# EAGLE design iv18 (EAGLE 7.4.0)
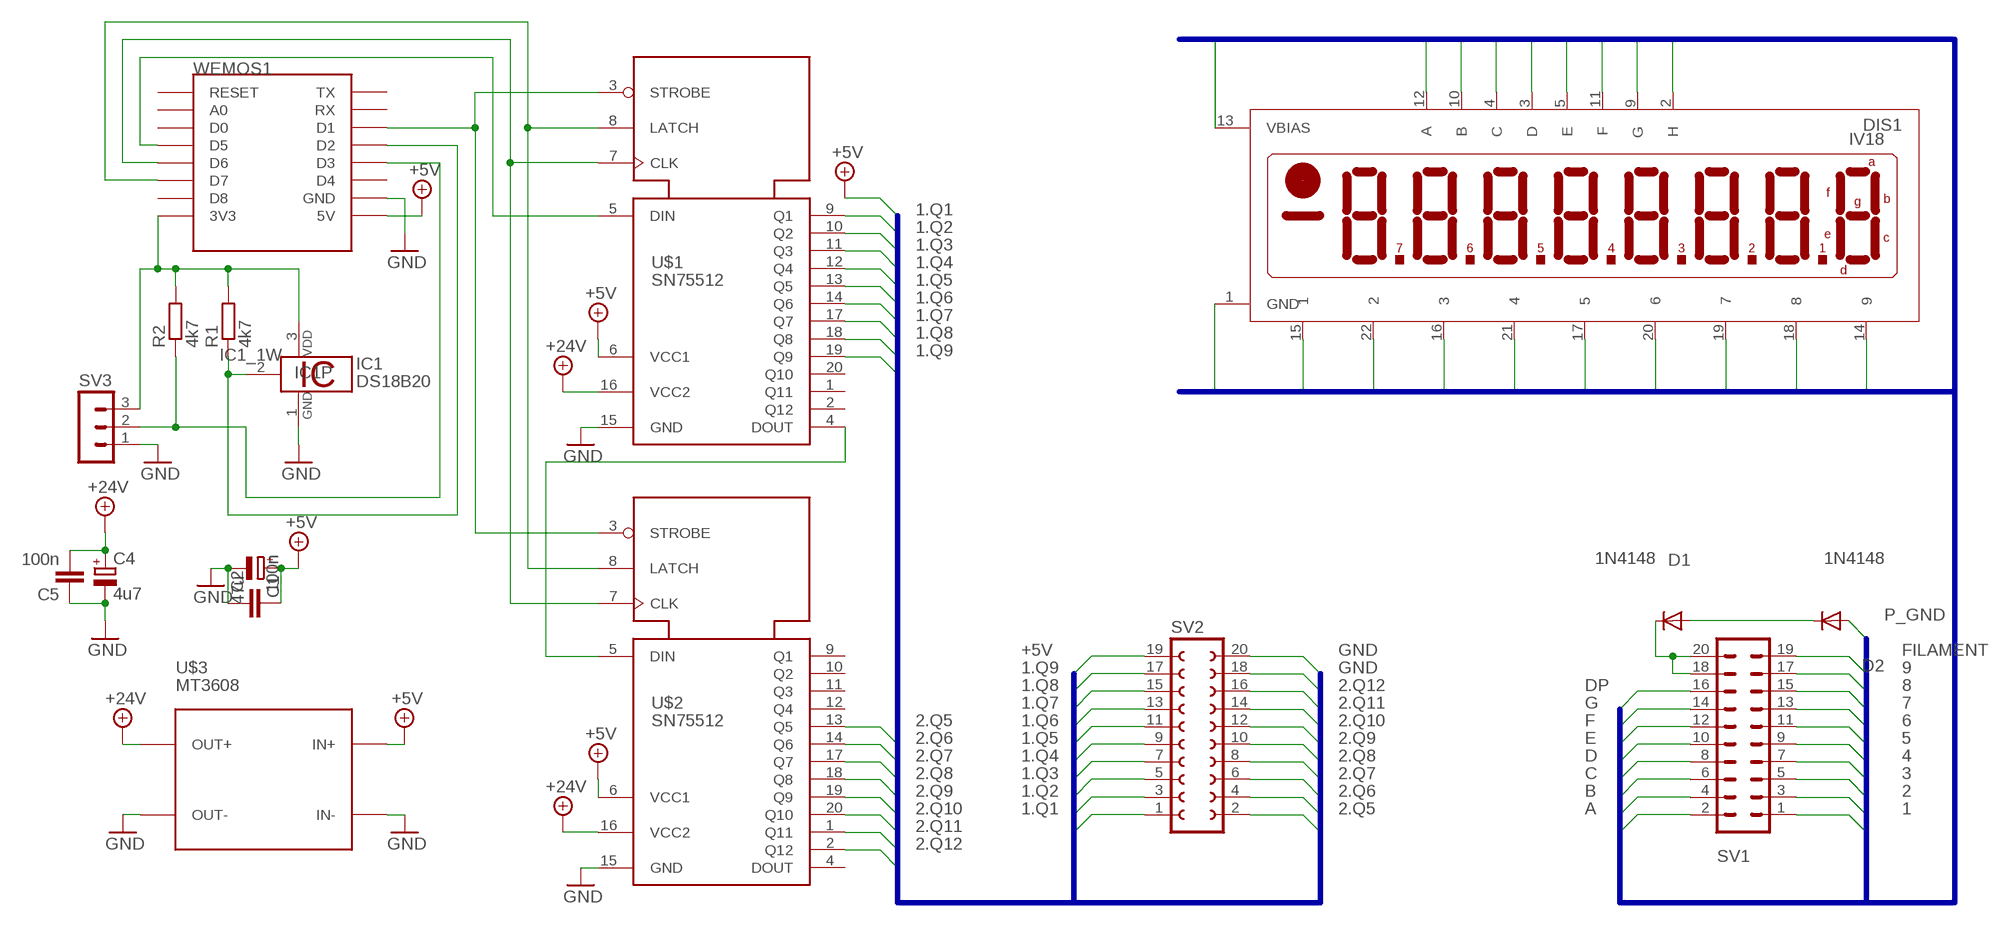
[diagram p0: schematic, sheet 1, part 1 of 2]
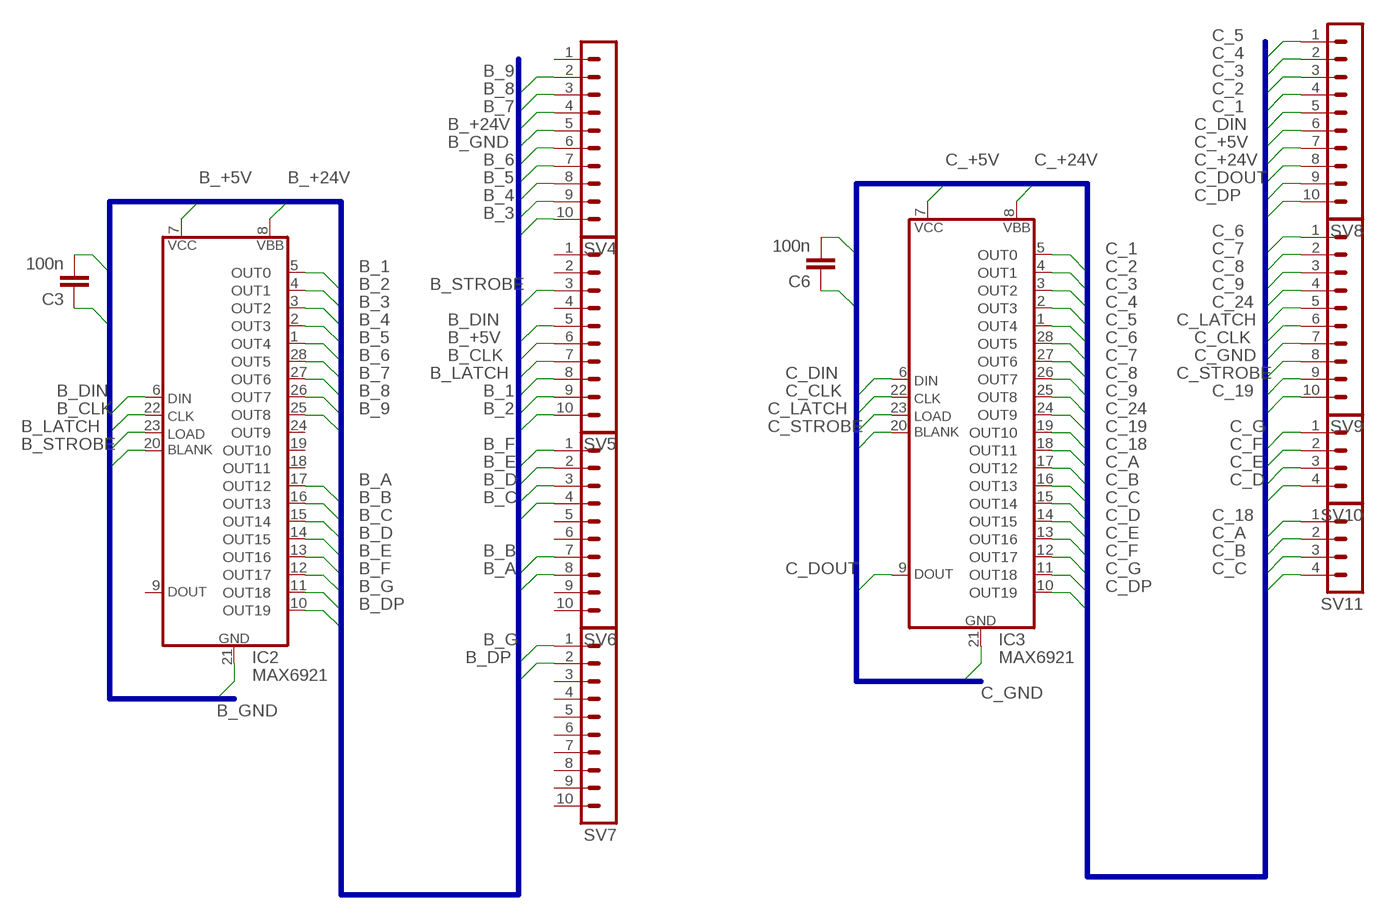
[diagram p1: schematic, sheet 1, part 2 of 2]

## Parts
C1  47u  CPOL-EUE2.5-7  [E2,5-7]
C2  100n  C-EU025-030X050  [C025-030X050]
C3  100n  C-EU025-030X050  [C025-030X050]
C4  4u7  CPOL-EUE2.5-5  [E2,5-5]
C5  100n  C-EU025-030X050  [C025-030X050]
C6  100n  C-EU025-030X050  [C025-030X050]
D1  1N4148  1N4148DO35-7  [DO35-7]
D2  1N4148  1N4148DO35-7  [DO35-7]
DIS1  IV18  [IV18]
IC1  DS18B20  [TO92-]
IC2  MAX6921  IC_MAX6921-TSSOP28  [TSSOP-28]
IC3  MAX6921  IC_MAX6921-TSSOP28  [TSSOP-28]
R1  4k7  R-EU_M1206  [M1206]
R2  4k7  R-EU_M1206  [M1206]
SV1  MA10-2W  [MA10-2W]
SV2  FE10-2  [FE10-2]
SV3  MA03-1  [MA03-1]
SV4  MA10-1  [MA10-1]
SV5  MA10-1  [MA10-1]
SV6  MA10-1  [MA10-1]
SV7  MA10-1  [MA10-1]
SV8  MA10-1  [MA10-1]
SV9  MA10-1  [MA10-1]
SV10  MA04-1  [MA04-1]
SV11  MA04-1  [MA04-1]
U$1  SN75512  [DIL20]
U$2  SN75512  [DIL20]
U$3  MT3608  DC-DC-STEP-UP-MT3608  [DC-DC-STEP-UP-MT3608]
WEMOS1  WEMOS-D1-MINI  [WEMOS-D1-MINI]

## Nets
1: DIS1.15 SV1.1
1.Q1: SV2.1 U$1.9(Q1)
1.Q2: SV2.3 U$1.10(Q2)
1.Q3: SV2.5 U$1.11(Q3)
1.Q4: SV2.7 U$1.12(Q4)
1.Q5: SV2.9 U$1.13(Q5)
1.Q6: SV2.11 U$1.14(Q6)
1.Q7: SV2.13 U$1.17(Q7)
1.Q8: SV2.15 U$1.18(Q8)
1.Q9: SV2.17 U$1.19(Q9)
2: DIS1.22 SV1.3
2.Q5: SV2.2 U$2.13(Q5)
2.Q6: SV2.4 U$2.14(Q6)
2.Q7: SV2.6 U$2.17(Q7)
2.Q8: SV2.8 U$2.18(Q8)
2.Q9: SV2.10 U$2.19(Q9)
2.Q10: SV2.12 U$2.20(Q10)
2.Q11: SV2.14 U$2.1(Q11)
2.Q12: SV2.16 U$2.2(Q12)
3: DIS1.16 SV1.5
4: DIS1.21 SV1.7
5: DIS1.17 SV1.9
6: DIS1.20 SV1.11
7: DIS1.19 SV1.13
8: DIS1.18 SV1.15
9: DIS1.14 SV1.17
+5V: C1.+ C2.2 SV2.19 U$1.6(VCC1) U$2.6(VCC1) U$3.IN+ WEMOS1.5V
+24V: C4.+ C5.2 U$1.16(VCC2) U$2.16(VCC2) U$3.OUT+
A: DIS1.12(A) SV1.2
B: DIS1.10(B) SV1.4
B_1: IC2.5(OUT0) SV5.9
B_2: IC2.4(OUT1) SV5.10
B_3: IC2.3(OUT2) SV4.10
B_4: IC2.2(OUT3) SV4.9
B_5: IC2.1(OUT4) SV4.8
B_6: IC2.28(OUT5) SV4.7
B_7: IC2.27(OUT6) SV4.4
B_8: IC2.26(OUT7) SV4.3
B_9: IC2.25(OUT8) SV4.2
B_+5V: C3.2 IC2.7(VCC) SV5.6
B_+24V: IC2.8(VBB) SV4.5
B_A: IC2.17(OUT12) SV6.8
B_B: IC2.16(OUT13) SV6.7
B_C: IC2.15(OUT14) SV6.4
B_CLK: IC2.22(CLK) SV5.7
B_D: IC2.14(OUT15) SV6.3
B_DIN: IC2.6(DIN) SV5.5
B_DP: IC2.10(OUT19) SV7.2
B_E: IC2.13(OUT16) SV6.2
B_F: IC2.12(OUT17) SV6.1
B_G: IC2.11(OUT18) SV7.1
B_GND: C3.1 IC2.21(GND) SV4.6
B_LATCH: IC2.23(LOAD) SV5.8
B_STROBE: IC2.20(BLANK) SV5.3
C: DIS1.4(C) SV1.6
C_1: IC3.5(OUT0) SV8.5
C_2: IC3.4(OUT1) SV8.4
C_3: IC3.3(OUT2) SV8.3
C_4: IC3.2(OUT3) SV8.2
C_5: IC3.1(OUT4) SV8.1
C_6: IC3.28(OUT5) SV9.1
C_7: IC3.27(OUT6) SV9.2
C_8: IC3.26(OUT7) SV9.3
C_9: IC3.25(OUT8) SV9.4
C_18: IC3.18(OUT11) SV11.1
C_19: IC3.19(OUT10) SV9.10
C_24: IC3.24(OUT9) SV9.5
C_+5V: C6.2 IC3.7(VCC) SV8.7
C_+24V: IC3.8(VBB) SV8.8
C_A: IC3.17(OUT12) SV11.2
C_B: IC3.16(OUT13) SV11.3
C_C: IC3.15(OUT14) SV11.4
C_CLK: IC3.22(CLK) SV9.7
C_D: IC3.14(OUT15) SV10.4
C_DIN: IC3.6(DIN) SV8.6
C_DOUT: IC3.9(DOUT) SV8.9
C_DP: IC3.10(OUT19) SV8.10
C_E: IC3.13(OUT16) SV10.3
C_F: IC3.12(OUT17) SV10.2
C_G: IC3.11(OUT18) SV10.1
C_GND: C6.1 IC3.21(GND) SV9.8
C_LATCH: IC3.23(LOAD) SV9.6
C_STROBE: IC3.20(BLANK) SV9.9
D: DIS1.3(D) SV1.8
DP: DIS1.2(H) SV1.16
E: DIS1.5(E) SV1.10
F: DIS1.11(F) SV1.12
FILAMENT: DIS1.13(VBIAS) SV1.19
G: DIS1.9(G) SV1.14
GND: C1.- C2.1 C4.- C5.1 IC1.1 SV2.18 SV2.20 SV3.1 U$1.15(GND) U$2.15(GND) U$3.IN- U$3.OUT- WEMOS1.GND
N$1: U$1.5(DIN) WEMOS1.D5
N$2: U$1.7(CLK) U$2.7(CLK) WEMOS1.D6
N$3: U$1.8(LATCH) U$2.8(LATCH) WEMOS1.D7
N$4: U$1.3(STROBE) U$2.3(STROBE) WEMOS1.D1
N$5: U$1.4(DOUT) U$2.5(DIN)
N$6: D1.A D2.C
N$7: IC1.3 R1.2 R2.2 SV3.3 WEMOS1.3V3
N$8: IC1.2 R1.1 WEMOS1.D2
N$9: R2.1 SV3.2 WEMOS1.D3
N$11: D1.C SV1.18 SV1.20
P_GND: D2.A DIS1.1(GND)
Unconnected: IC2.9(DOUT) IC2.18(OUT11) IC2.19(OUT10) IC2.24(OUT9) SV4.1 SV5.1 SV5.2 SV5.4 SV6.5 SV6.6 SV6.9 SV6.10 SV7.3 SV7.4 SV7.5 SV7.6 SV7.7 SV7.8 SV7.9 SV7.10 U$1.1(Q11) U$1.2(Q12) U$1.20(Q10) U$2.4(DOUT) U$2.9(Q1) U$2.10(Q2) U$2.11(Q3) U$2.12(Q4) WEMOS1.A0 WEMOS1.D0 WEMOS1.D4 WEMOS1.D8 WEMOS1.RESET WEMOS1.RX WEMOS1.TX

## Buses
1.Q1,1.Q2,1.Q3,1.Q4,1.Q5,1.Q6,1.Q7,1.Q8,1.Q9,2.Q5,2.Q6,2.Q7,2.Q8,2.Q9,2.Q10,2.Q11,2.Q12,+5V,GND
PANELBUSZ:FILAMENT,P_GND,A,B,C,D,E,F,G,DP,1,2,3,4,5,6,7,8,9
BOBBUSZ2:C_GND,C_+24V,C_+5V,C_CLK,C_DIN,C_DOUT,C_LATCH,C_STROBE,C_1,C_2,C_3,C_4,C_5,C_6,C_7,C_8,C_9,C_DP,C_G,C_F,C_E,C_D,C_C,C_B,C_A,C_24,C_19,C_18

## Library data of the parts
C1 C4 = rcl:CPOL-EU: POLARIZED CAPACITOR, European symbol
C2 C3 C5 C6 = rcl:C-EU: CAPACITOR, European symbol
D1 D2 = diode:1N4148: DIODE high speed (Philips)
DIS1 = adafruit:IV18: LCD DISPLAY 8-character 7 segment
IC1 = 1wire:DS18B20: Programmable Resolution Digital Thermometer This chip provides a onewire thermosensor with approx. 0.5°C accuracy. A programmable over/undertemperure alarm is available. The precision can be set from 9..12 bits. Notes: Vdd must be applied for accurate measurements at low temperatures, as the parasite power circuit otherwise heats the sensor. If parasite power is used, Vdd has to be connected to GND. The DS1822 is a low-cost thermometer chip, the DS18S20 is similar to the DS18B20, but with 9 Bit precision only. Author: Jan Kandziora <jjj@gmx.de>
IC2 IC3 = dp_devices.v6:IC_MAX6921: 20-outputs, 76V, serial VFD driver Dangerousprototypes.com
R1 R2 = rcl:R-EU_: RESISTOR, European symbol
SV1 = con-lstb:MA10-2W: PIN HEADER; OC_FARNELL: unknown; OC_NEWARK: unknown
SV2 = con-lsta:FE10-2: FEMALE HEADER; OC_FARNELL: unknown; OC_NEWARK: unknown
SV3 = con-lstb:MA03-1: PIN HEADER; OC_FARNELL: unknown; OC_NEWARK: unknown
SV4-SV9 = con-lstb:MA10-1: PIN HEADER; OC_FARNELL: unknown; OC_NEWARK: unknown
SV10 SV11 = con-lstb:MA04-1: PIN HEADER; OC_FARNELL: unknown; OC_NEWARK: unknown
U$1 U$2 = 755xx:SN75512
U$3 = diy-modules:DC-DC-STEP-UP-MT3608: DC/DC Step-Up Regulator based on MT3608 chip MT3608 datasheet available here: https://www.olimex.com/Products/Breadboarding/BB-PWR-3608/resources/MT3608.pdf Click here to find device on ebay.com <http://www.ebay.com/sch/mt3608+module>
WEMOS1 = esp8266modules:WEMOS-D1-MINI: WeMos.cc D1 mini ESP8266 module

## Board
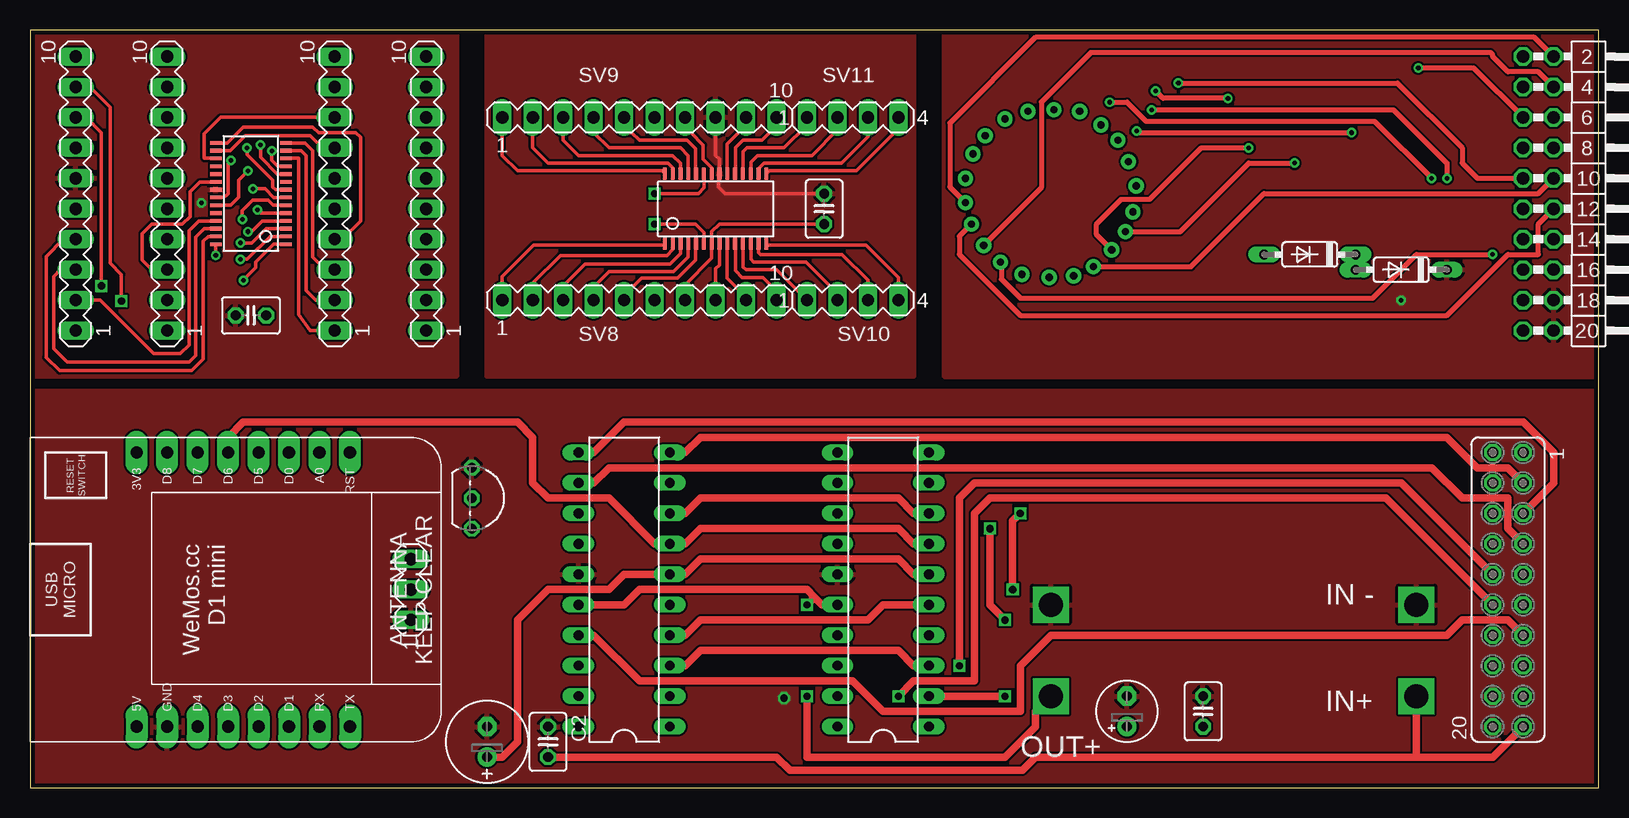
[diagram p2: board, top side]
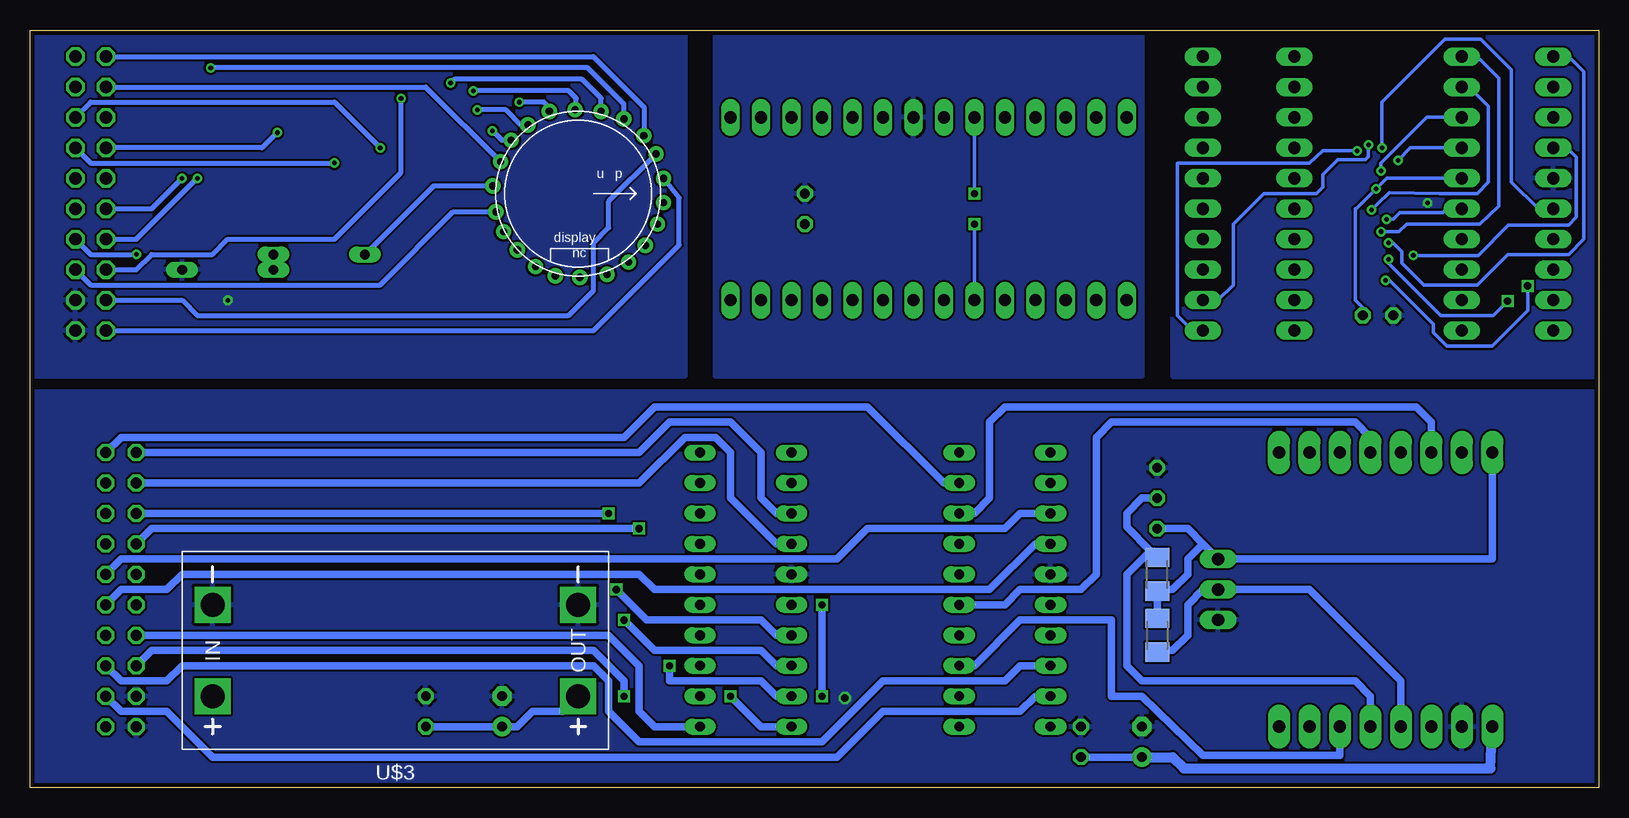
[diagram p3: board, bottom side, seen from below]

Size 130.79 x 63.17 mm. Coordinates in mm from the lower left corner, seen from the top.
Outline: 0,0 130.79,0 130.79,63.17 0,63.17 0,0
Copper layers (1*16): Top 0.035mm / dielectric 1.5mm / Bottom 0.035mm
Design rules "default *": minimum track width 5mil, minimum drill 12mil, track to track 7mil, track to pad 5mil, pad to pad 5mil, via to via 5mil, smd to smd 5mil, copper to edge 15mil, drill to drill 8mil, minimum pad ring 10mil, minimum via ring 8mil, stop-mask expansion 4mil, vias tented up to drill 0mil, thermal gap 10mil

### Footprints (pad centres in the part's own frame; a part is rotated, then mirrored left to right if it is on the bottom)
E2,5-7 = drill 0.813 pad 1.6: + -1.27,0 | drill 0.813 pad 1.6 octagon: - 1.27,0
C025-030X050 = drill 0.813 octagon: 1 -1.27,0; 2 1.27,0
E2,5-5 = drill 0.813 pad 1.6: + -1.27,0 | drill 0.813 pad 1.6 octagon: - 1.27,0
DO35-7 = drill 0.813 long: A 3.81,0; C -3.81,0
IV18 = drill 0.6 pad 1.27: 1 -0.635,-7.112; 2 1.524,-6.858; 3 3.175,-6.223; 4 4.699,-5.08; 5 6.096,-3.556; 6 6.858,-1.905; 7 6.985,0.127; 8 6.731,2.413; 9 5.715,4.191; 10 4.318,5.588; 11 2.54,6.604; 12 0.762,7.112; 13 -1.27,7.112; 14 -3.302,6.477; 15 -4.826,5.461; 16 -6.223,3.81; 17 -6.858,1.905; 18 -6.985,-0.254; 19 -6.858,-2.413; 20 -5.715,-4.191; 21 -4.445,-5.588; 22 -2.667,-6.477
TO92- = drill 0.813 octagon: 1 -2.54,0; 2 0,0; 3 2.54,0
TSSOP-28 = smd 0.305 x 0.991: 1 -4.225,-2.918; 2 -3.575,-2.918; 3 -2.925,-2.918; 4 -2.275,-2.918; 5 -1.625,-2.918; 6 -0.975,-2.918; 7 -0.325,-2.918; 8 0.325,-2.918; 9 0.975,-2.918; 10 1.625,-2.918; 11 2.275,-2.918; 12 2.925,-2.918; 13 3.575,-2.918; 14 4.225,-2.918; 15 4.225,2.918; 16 3.575,2.918; 17 2.925,2.918; 18 2.275,2.918; 19 1.625,2.918; 20 0.975,2.918; 21 0.325,2.918; 22 -0.325,2.918; 23 -0.975,2.918; 24 -1.625,2.918; 25 -2.275,2.918; 26 -2.925,2.918; 27 -3.575,2.918; 28 -4.225,2.918
M1206 = smd 1.6 x 2: 1 -1.4,0; 2 1.4,0
MA10-2W = drill 1.016 octagon: 1 -11.43,-1.27; 2 -11.43,1.27; 3 -8.89,-1.27; 4 -8.89,1.27; 5 -6.35,-1.27; 6 -6.35,1.27; 7 -3.81,-1.27; 8 -3.81,1.27; 9 -1.27,-1.27; 10 -1.27,1.27; 11 1.27,-1.27; 12 1.27,1.27; 13 3.81,-1.27; 14 3.81,1.27; 15 6.35,-1.27; 16 6.35,1.27; 17 8.89,-1.27; 18 8.89,1.27; 19 11.43,-1.27; 20 11.43,1.27
FE10-2 = drill 0.914 octagon: 1 -11.43,1.27; 2 -11.43,-1.27; 3 -8.89,1.27; 4 -8.89,-1.27; 5 -6.35,1.27; 6 -6.35,-1.27; 7 -3.81,1.27; 8 -3.81,-1.27; 9 -1.27,1.27; 10 -1.27,-1.27; 11 1.27,1.27; 12 1.27,-1.27; 13 3.81,1.27; 14 3.81,-1.27; 15 6.35,1.27; 16 6.35,-1.27; 17 8.89,1.27; 18 8.89,-1.27; 19 11.43,1.27; 20 11.43,-1.27
MA03-1 = drill 1.016 long: 1 -2.54,0; 2 0,0; 3 2.54,0
MA10-1 = drill 1.016 long: 1 -11.43,0; 2 -8.89,0; 3 -6.35,0; 4 -3.81,0; 5 -1.27,0; 6 1.27,0; 7 3.81,0; 8 6.35,0; 9 8.89,0; 10 11.43,0
MA04-1 = drill 1.016 long: 1 -3.81,0; 2 -1.27,0; 3 1.27,0; 4 3.81,0
DIL20 = drill 0.813 long: 1 -11.43,-3.81; 2 -8.89,-3.81; 3 -6.35,-3.81; 4 -3.81,-3.81; 5 -1.27,-3.81; 6 1.27,-3.81; 7 3.81,-3.81; 8 6.35,-3.81; 9 8.89,-3.81; 10 11.43,-3.81; 11 11.43,3.81; 12 8.89,3.81; 13 6.35,3.81; 14 3.81,3.81; 15 1.27,3.81; 16 -1.27,3.81; 17 -3.81,3.81; 18 -6.35,3.81; 19 -8.89,3.81; 20 -11.43,3.81
DC-DC-STEP-UP-MT3608 = drill 2 pad 2.8 square: IN+ 15.24,3.81; IN- 15.24,-3.81; OUT+ -15.24,3.81; OUT- -15.24,-3.81
WEMOS-D1-MINI = drill 1.016 pad 1.829 long: 3V3 -10.16,-10.16; 5V 12.7,-10.16; A0 -10.16,5.08; D0 -10.16,2.54; D1 12.7,2.54; D2 12.7,0; D3 12.7,-2.54; D4 12.7,-5.08; D5 -10.16,0; D6 -10.16,-2.54; D7 -10.16,-5.08; D8 -10.16,-7.62; GND 12.7,-7.62; RESET -10.16,7.62; RX 12.7,5.08; TX 12.7,7.62

### Placement (x,y rotation side)
C1  38.1,3.81 90 top
C2  43.18,3.81 270 top
C3  18.41,39.37 0 top
C4  91.44,6.35 90 top
C5  97.79,6.35 270 top
C6  66.2,48.26 270 top
D1  114.3,43.18 180 top
D2  106.68,44.45 180 top
DIS1  85.09,49.53 270 bottom
IC1  36.83,24.13 270 top
IC2  18.41,49.53 90 top
IC3  57.15,48.26 0 top
R1  36.83,17.78 270 bottom
R2  36.83,12.7 90 bottom
SV1  125.73,49.53 270 top
SV2  123.19,16.51 270 top
SV3  31.75,16.51 90 top
SV4  3.81,49.53 90 top
SV5  11.43,49.53 90 top
SV6  25.4,49.53 90 top
SV7  33.02,49.53 90 top
SV8  50.8,40.64 0 top
SV9  50.8,55.88 0 top
SV10  68.58,40.64 0 top
SV11  68.58,55.88 0 top
U$1  49.53,16.51 90 top
U$2  71.12,16.51 90 top
U$3  100.33,11.43 180 bottom
WEMOS1  19.05,17.78 270 top

### Tracks (layer width: path | path; a pad name or v marks a point on that pad's centre or on a via)
1
  Bottom 0.406: SV1.1 83.82,60.96 79.61,56.75 79.61,54.37 DIS1.15
1.Q1
  Bottom 0.61: SV2.1 123.19,29.21 81.28,29.21 78.74,31.75 60.96,31.75 54.61,25.4 U$1.9
1.Q2
  Top 0.61: SV2.3 123.19,26.67 120.65,26.67 118.11,29.21 55.88,29.21 54.61,27.94 U$1.10
1.Q3
  Top 0.61: SV2.5 127,25.4 127,27.94 124.46,30.48 49.53,30.48 46.99,27.94 U$1.11
1.Q4
  Top 0.61: SV2.7 123.19,21.59 123.19,24.13 119.38,24.13 116.84,26.67 48.26,26.67 46.99,25.4 U$1.12
1.Q5
  Bottom 0.61: SV2.9 123.19,19.05 63.5,19.05 60.96,21.59 49.53,21.59 48.26,22.86 U$1.13
1.Q6
  Bottom 0.61: SV2.11 123.19,16.51 119.38,16.51 118.11,17.78 80.01,17.78 78.74,16.51 50.8,16.51 46.99,20.32 U$1.14
1.Q7
  Top 0.61: SV2.13 123.19,13.97 119.38,13.97 118.11,12.7 85.09,12.7 82.55,10.16 82.55,6.35 71.12,6.35 68.58,8.89 50.8,8.89 46.99,12.7 U$1.17
1.Q8
  Bottom 0.61: SV2.15 123.19,8.89 119.38,8.89 118.11,10.16 83.82,10.16 82.55,8.89 82.55,6.35 80.01,3.81 64.77,3.81 59.69,8.89 49.53,8.89 48.26,10.16 U$1.18
1.Q9
  Bottom 0.61: SV2.17 123.19,6.35 119.38,6.35 115.57,2.54 63.5,2.54 59.69,6.35 48.26,6.35 46.99,7.62 U$1.19
2
  Bottom 0.406: SV1.3 97.79,58.42 DIS1.22
2.Q5
  Bottom 0.61: SV2.2 80.01,27.94 77.47,30.48 72.39,30.48 69.85,27.94 69.85,24.13 68.58,22.86 U$2.13
2.Q6
  Bottom 0.61: SV2.4 80.01,25.4 76.2,29.21 73.66,29.21 72.39,27.94 72.39,24.13 68.58,20.32 U$2.14
2.Q7  (via drill 0.6)
  Top 0.61: v82.55,22.86 81.92,22.23 v81.92,16.51
  Bottom 0.61: SV2.6 v82.55,22.86 | v81.92,16.51 79.38,13.97 69.85,13.97 68.58,12.7 U$2.17
2.Q8  (via drill 0.6)
  Top 0.61: v80.01,21.59 80.01,15.24 v81.28,13.97
  Bottom 0.61: SV2.8 120.65,21.59 v80.01,21.59 | v81.28,13.97 78.74,11.43 69.85,11.43 68.58,10.16 U$2.18
2.Q9  (via drill 0.6)
  Top 0.61: SV2.10 114.3,25.4 78.74,25.4 77.47,24.13 v77.47,10.16
  Bottom 0.61: v77.47,10.16 77.47,8.89 69.85,8.89 68.58,7.62 U$2.19
2.Q10  (via drill 0.6)
  Top 0.61: SV2.12 113.03,24.13 80.01,24.13 78.74,22.86 78.74,8.89 73.66,8.89 v72.39,7.62
  Bottom 0.61: v72.39,7.62 69.85,5.08 U$2.20
2.Q11
  Bottom 0.61: SV2.14 82.55,12.7 80.01,10.16 80.01,6.35 78.74,5.08 U$2.1
2.Q12  (via drill 0.6)
  Top 0.61: v81.28,7.62 U$2.2
  Bottom 0.61: SV2.16 120.65,11.43 83.82,11.43 81.28,8.89 v81.28,7.62
3  (via drill 0.38)
  Top 0.406: v115.73,60.01 120.33,60.01 SV1.5
  Bottom 0.406: DIS1.16 81.28,56.99 84.3,60.01 v115.73,60.01
4  (via drill 0.38)
  Top 0.406: v92.23,54.77 92.39,54.61 v110.17,54.61
  Bottom 0.406: DIS1.21 91.44,53.98 v92.23,54.77 | v110.17,54.61 111.44,53.34 SV1.7
5  (via drill 0.38)
  Top 0.406: v95.73,58.74 113.98,58.74 119.38,53.34 119.38,52.07 120.65,50.8 SV1.9
  Bottom 0.406: DIS1.17 83.19,57.47 84.77,59.05 95.41,59.05 v95.73,58.74
6  (via drill 0.38)
  Top 0.406: v93.5,56.52 113.67,56.52 118.11,52.07 v118.11,50.8
  Bottom 0.406: DIS1.20 89.85,55.24 91.12,56.52 v93.5,56.52 | SV1.11 120.65,48.26 v118.11,50.8
7  (via drill 0.38)
  Top 0.406: v90.01,57.15 91.44,57.15 93.03,55.56 112.08,55.56 v116.84,50.8
  Bottom 0.406: DIS1.19 87.5,56.71 87.95,57.15 v90.01,57.15 | SV1.13 121.92,45.72 v116.84,50.8
8  (via drill 0.38)
  Top 0.406: v99.85,57.47 94.46,57.47 v93.82,58.1
  Bottom 0.406: DIS1.18 85.25,56.61 85.25,57.47 85.88,58.1 v93.82,58.1 | SV1.15 121.92,43.18 120.65,44.45 115.57,44.45 114.3,45.72 105.41,45.72 99.85,51.28 v99.85,57.47
9
  Bottom 0.406: SV1.17 118.11,40.64 116.84,39.37 85.88,39.37 83.82,41.43 83.82,45.4 82.55,46.67 82.55,48.9 DIS1.14
+5V
  Top 0.61: U$2.6 73.66,17.78 72.39,19.05 55.88,19.05 54.61,17.78 U$1.6 49.53,17.78 48.26,16.51 43.18,16.51 40.64,13.97 40.64,3.81 39.37,2.54 C1.+ | SV2.19 121.92,2.54 115.57,2.54 | 115.57,2.54 83.82,2.54 82.71,1.43 63.34,1.43 62.23,2.54 C2.2 | U$3.IN+ 115.57,2.54
  Bottom 0.61: C1.+ C2.2
  Bottom 0.813: C1.+ 35.56,2.54 34.61,1.59 9.05,1.59 WEMOS1.5V
+24V  (via drill 0.6)
  Top 0.61: U$2.16 66.04,15.24 65.41,15.88 | 65.41,15.88 64.77,16.51 50.8,16.51 49.53,15.24 U$1.16 | U$3.OUT+ 83.82,6.35 83.82,5.08 81.28,2.54 64.77,2.54 v64.77,7.62 | v64.77,15.24 65.41,15.88
  Bottom 0.61: U$3.OUT+ 86.36,6.35 88.9,6.35 90.17,5.08 C4.+ C5.2 | v64.77,7.62 v64.77,15.24
A
  Top 0.406: SV1.2 125.41,62.55 83.82,62.55 76.68,55.4 76.68,50.07 DIS1.12
B
  Top 0.406: SV1.4 125.73,59.69 123.19,59.69 121.92,60.96 121.92,61.12 121.76,61.28 88.42,61.28 84.3,57.15 84.3,50.01 DIS1.10
B_1  (via drill 0.38)
  Top 0.305: v18.97,48.18 19.25,47.91 IC2.5
  Bottom 0.305: SV5.9 10.79,58.42 9.21,56.83 9.21,50.48 10.16,49.53 13.26,49.53 17.46,49.61 18.49,48.66 v18.97,48.18
B_2  (via drill 0.38)
  Top 0.305: IC2.4 21.31,47.23 19.37,47.23 18.49,46.35 v18.18,46.35
  Bottom 0.305: SV5.10 10.16,60.96 8.33,59.13 8.33,48.5 9.92,46.99 16.03,46.99 16.67,46.35 v18.18,46.35
B_3  (via drill 0.38)
  Top 0.305: IC2.3 21.32,46.59 19.68,46.59 18.49,45.4 v17.54,45.4
  Bottom 0.305: v17.54,45.4 17.14,45.4 16.43,44.69 16.43,43.74 14.61,41.91 10.16,41.91 7.62,44.45 2.54,44.45 1.27,45.72 1.27,59.69 2.54,60.96 SV4.10
B_4  (via drill 0.38, 0.6)
  Top 0.305: IC2.2 20,45.96 18.1,44.05 v17.54,44.05 | v7.62,40.56 7.62,42.78 6.67,43.74 6.67,56.75 4.92,58.5 3.89,58.5 SV4.9
  Bottom 0.305: v17.54,44.05 17.54,43.74 13.18,39.37 8.81,39.37 v7.62,40.56
B_5  (via drill 0.38, 0.6)
  Top 0.305: IC2.1 20.3,45.3 18.81,43.81 18.81,43.34 v17.78,42.31 | v5.95,41.83 5.95,54.61 4.68,55.88 SV4.8
  Bottom 0.305: v17.78,42.31 17.46,42.31 13.81,38.66 13.81,37.94 12.7,36.83 8.89,36.83 5.95,39.77 v5.95,41.83
B_6  (via drill 0.38)
  Top 0.305: IC2.28 15.5,44.39 v15.48,44.37
  Bottom 0.305: v15.48,44.37 10.08,44.37 7.54,46.91 2.54,46.91 1.91,47.55 1.91,52.55 2.7,53.34 SV4.7
B_7
  Top 0.305: IC2.27 14.84,45.96 14.45,45.56 14.45,35.72 13.49,34.77 2.46,34.77 1.35,35.88 1.35,44.29 2.78,45.72 SV4.4
B_8
  Top 0.305: IC2.26 15.48,46.59 14.53,46.59 13.81,45.88 13.81,36.04 13.26,35.48 3.1,35.48 1.98,36.59 1.98,42.62 2.54,43.18 SV4.3
B_9
  Top 0.305: IC2.25 15.47,47.23 14.05,47.23 13.26,46.43 13.26,36.91 12.54,36.2 10.32,36.2 5.87,40.64 SV4.2
B_+5V  (via drill 0.38)
  Top 0.305: IC2.7 20.33,49.2 19.61,49.93 v18.57,49.93
  Bottom 0.305: SV5.6 17.7,50.8 v18.57,49.93 20.24,48.26 20.32,48.26 20.32,40.64 19.68,40.01 C3.2
B_+24V  (via drill 0.38)
  Top 0.305: IC2.8 20.64,49.85 20.48,49.85 20.24,50.09 20.24,50.64 18.1,52.78 v18.1,53.34
  Bottom 0.305: SV4.5 5.08,48.26 7.3,50.48 7.3,59.85 9.84,62.39 12.86,62.39 18.1,57.15 v18.1,53.34
B_A
  Top 0.305: IC2.17 15.48,52.47 14.53,52.47 14.53,54.53 15.88,55.88 SV6.8
B_B
  Top 0.305: IC2.16 16.67,53.1 17.94,54.37 23.34,54.37 24.37,53.34 SV6.7
B_C
  Top 0.305: IC2.15 15.52,53.74 16.43,53.74 17.78,55.09 23.57,55.09 24.05,54.61 27.15,54.61 27.54,54.21 27.54,47.23 26.04,45.72 SV6.4
B_CLK  (via drill 0.38)
  Top 0.305: IC2.22 15.51,49.21 16.11,49.21 16.35,49.37 16.51,49.53 16.51,51.99 v16.75,52.31
  Bottom 0.305: 12.86,53.34 SV5.7 15.72,53.34 v16.75,52.31
B_D
  Top 0.305: IC2.14 21.35,53.74 22.94,53.74 23.57,53.1 23.57,44.21 24.61,43.18 SV6.3
B_DIN  (via drill 0.38)
  Top 0.305: IC2.6 20.26,48.55 19.84,48.97 18.57,48.97 17.7,48.1 v17.7,47.39
  Bottom 0.305: SV5.5 12.7,48.26 13.02,47.94 16.59,47.94 17.14,47.39 v17.7,47.39
B_DP  (via drill 0.38)
  Top 0.305: IC2.10 20.6,51.16 19.21,52.55 v19.21,53.58
  Bottom 0.305: SV7.2 31.75,40.64 30.48,41.91 30.48,46.99 27.94,49.53 23.57,49.53 23.02,50.09 23.02,51.12 21.79,52.35 19.49,52.35 19.21,52.63 v19.21,53.58
B_E
  Top 0.305: IC2.13 22.62,53.1 23.02,52.7 23.02,41.43 23.81,40.64 SV6.2
B_F
  Top 0.305: SV6.1 23.34,38.1 22.38,39.45 22.38,52.47 21.34,52.47 IC2.12
B_G  (via drill 0.38)
  Top 0.305: IC2.11 20.66,51.8 20.16,52.31 v20.16,53.1
  Bottom 0.305: v20.16,53.1 23.02,53.1 24.13,52.07 35.16,52.07 35.16,39.37 33.89,38.1 SV7.1
B_GND  (via drill 0.38)
  other vias: 14.29,48.74
  pour Bottom: 0,34.29 0,63.18 35.56,63.18 35.56,34.29
  pour Top: 0,34.29 0,63.18 35.56,63.18 35.56,34.29
B_LATCH  (via drill 0.38)
  Top 0.305: IC2.23 15.52,48.58 16.75,48.58 17.38,49.21 17.38,50.64 v18.18,51.44
  Bottom 0.305: 11.59,55.88 SV5.8 14.37,55.88 18.18,52.07 v18.18,51.44
B_STROBE
  Top 0.305: IC2.20 15.47,50.48 14.13,50.48 13.34,49.69 13.34,47.62 12.7,46.99 10.16,46.99 9.37,46.2 9.37,43.97 10.16,43.18 SV5.3
C  (via drill 0.38)
  Top 0.406: DIS1.4 88.9,46.1 88.9,46.99 90.96,49.05 93.34,49.05 97.63,53.34 v101.6,53.34
  Bottom 0.406: SV1.6 125.73,57.15 105.41,57.15 v101.6,53.34
C_1
  Top 0.305: IC3.5 55.48,45.3 55.48,43.97 53.98,42.47 50.96,42.47 49.53,41.04 SV8.5
C_2
  Top 0.305: IC3.4 54.85,45.31 54.85,44.21 53.66,43.02 48.26,43.02 46.99,41.75 SV8.4
C_3
  Top 0.305: IC3.3 54.21,45.33 54.21,44.53 53.34,43.66 46.28,43.66 44.45,41.83 SV8.3
C_4
  Top 0.305: IC3.2 53.58,44.85 53.1,44.37 44.21,44.37 41.91,42.07 SV8.2
C_5
  Top 0.305: IC3.1 52.83,45.24 41.99,45.24 39.37,42.62 SV8.1
C_6
  Top 0.305: IC3.28 52.67,51.44 40.64,51.44 39.37,52.7 SV9.1
C_7
  Top 0.305: IC3.27 53.58,51.67 53.18,52.07 43.18,52.07 41.91,53.34 SV9.2
C_8
  Top 0.305: IC3.26 54.21,51.19 54.21,52.07 53.58,52.7 45.72,52.7 44.45,53.98 SV9.3
C_9
  Top 0.305: IC3.25 54.85,51.2 54.85,52.7 54.21,53.34 48.26,53.34 46.99,54.61 SV9.4
C_18
  Top 0.305: IC3.18 59.45,51.2 59.45,53.02 59.77,53.34 62.87,53.34 64.77,55.24 SV11.1
C_19
  Top 0.305: IC3.19 58.82,51.22 58.82,53.34 59.45,53.98 61.04,53.98 62.23,55.17 SV9.10
C_24
  Top 0.305: IC3.24 55.48,51.22 55.48,53.26 54.77,53.98 50.8,53.98 50.16,54.61 49.53,54.61 SV9.5
C_+5V
  Top 0.305: C6.2 57.47,46.99 56.83,46.35 56.83,45.35 IC3.7 56.83,45.34 56.83,44.13 54.61,41.91 SV8.7
C_+24V
  Top 0.305: IC3.8 57.47,45.34 57.47,43.58 57.15,43.26 SV8.8
C_A
  Top 0.305: IC3.17 60.09,51.19 60.09,52.15 60.64,52.7 65.17,52.7 67.31,54.85 SV11.2
C_B
  Top 0.305: IC3.16 60.72,51.59 61.2,52.07 67.63,52.07 69.85,54.29 SV11.3
C_C
  Top 0.305: IC3.15 61.63,51.44 68.9,51.44 72.39,54.93 SV11.4
C_CLK
  Top 0.305: IC3.22 56.83,51.19 56.83,51.67 56.12,52.39 56.12,53.58 55.09,54.61 54.61,54.61 SV9.7
C_D
  Top 0.305: IC3.14 61.47,45.24 69.69,45.24 72.39,42.55 SV10.4
C_DIN  (via drill 0.6)
  Top 0.305: IC3.6 56.2,45.37 56.2,46.28 55.48,46.99 v52.07,46.99
  Bottom 0.305: v52.07,46.99 SV8.6
C_DOUT
  Top 0.305: IC3.9 58.1,45.32 58.1,42.47 59.69,40.88 SV8.9
C_DP
  Top 0.305: IC3.10 58.82,45.3 58.82,43.1 59.37,42.55 61.12,42.55 62.23,41.43 SV8.10
C_E
  Top 0.305: IC3.13 60.72,44.61 60.88,44.45 67.71,44.45 69.85,42.31 SV10.3
C_F
  Top 0.305: IC3.12 60.09,45.33 60.09,44.05 60.33,43.81 64.69,43.81 67.31,41.2 SV10.2
C_G
  Top 0.305: IC3.11 59.45,45.31 59.45,43.42 59.69,43.18 62.23,43.18 SV10.1
C_GND
  Top 0.305: SV9.8 57.15,52.7 57.47,52.39 57.47,51.19 IC3.21 57.39,51.09 57.39,50.09 57.94,49.53 C6.1
  pour Bottom: 38.1,34.29 73.66,34.29 73.66,63.18 38.1,63.18
  pour Top: 73.66,34.29 38.1,34.29 38.1,63.18 73.66,63.18
C_LATCH  (via drill 0.6)
  Top 0.305: IC3.23 56.2,51.16 56.2,50.01 55.72,49.53 v52.07,49.53
  Bottom 0.305: v52.07,49.53 SV9.6
C_STROBE
  Top 0.305: IC3.20 58.1,51.2 58.1,53.66 59.69,55.24 SV9.9
D  (via drill 0.38)
  Top 0.406: DIS1.3 95.89,46.35 101.6,52.07 v105.41,52.07
  Bottom 0.406: SV1.8 125.73,52.07 v105.41,52.07
DP
  Bottom 0.406: SV1.16 125.73,41.91 101.6,41.91 95.5,48.01 DIS1.2
E
  Top 0.406: DIS1.5 96.77,43.43 102.87,49.53 125.73,49.53 SV1.10
F
  Top 0.406: DIS1.11 77.47,45.97 77.47,44.45 82.55,39.37 118.11,39.37 123.19,44.45 125.73,44.45 125.73,46.99 SV1.12
FILAMENT
  Bottom 0.406: SV1.19 83.82,38.1 76.68,45.24 76.68,49.18 DIS1.13
G  (via drill 0.38)
  Top 0.406: DIS1.9 80.96,43.75 80.96,42.39 82.55,40.8 111.92,40.8 115.57,44.45 v121.92,44.45
  Bottom 0.406: SV1.14 125.73,44.45 v121.92,44.45
GND  (via drill 0.6)
  other vias: 62.87,7.46
  pour Bottom: 130.81,0 130.81,33.02 0,33.02 0,0
  pour Top: 130.81,0 130.81,33.02 0,33.02 0,0
N$1
  Bottom 0.61: U$1.5 49.53,15.24 48.26,16.51 43.18,16.51 41.91,17.78 41.91,29.21 40.64,30.48 20.32,30.48 19.05,29.21 WEMOS1.D5
N$2
  Top 0.61: U$2.7 73.66,20.32 72.39,21.59 55.88,21.59 54.61,20.32 U$1.7 52.07,20.32 48.26,24.13 43.18,24.13 41.91,25.4 41.91,29.21 40.64,30.48 17.78,30.48 16.51,29.21 WEMOS1.D6
N$3
  Top 0.61: U$2.8 73.66,22.86 72.39,24.13 55.88,24.13 54.61,22.86 U$1.8
  Bottom 0.61: U$1.8 52.07,22.86 50.8,24.13 50.8,30.48 49.53,31.75 15.24,31.75 13.97,30.48 WEMOS1.D7
N$4
  Top 0.61: U$2.3 73.66,10.16 72.39,11.43 55.88,11.43 54.61,10.16 U$1.3
  Bottom 0.61: WEMOS1.D1 21.59,2.7 33.02,2.7 38.1,7.62 40.64,7.62 40.64,13.97 48.26,13.97 52.07,10.16 U$1.3
N$5
  Top 0.61: U$2.5 71.12,15.24 69.85,13.97 55.88,13.97 54.61,12.7 U$1.4
N$6
  Bottom 0.406: D2.C D1.A
N$7
  Bottom 0.61: WEMOS1.3V3 8.89,19.05 SV3.3 33.02,20.32 | 33.02,20.32 34.29,21.59 IC1.3 | R2.2 R1.2 36.7,16.51 35.56,16.51 34.29,17.78 34.29,19.05 33.02,20.32
N$8
  Bottom 0.61: R1.1 37.4,19.75 | 37.4,19.75 39.37,21.72 39.37,22.86 38.1,24.13 IC1.2 | WEMOS1.D2 19.05,7.62 20.32,8.89 38.1,8.89 39.37,10.16 39.37,17.78 37.4,19.75
N$9
  Bottom 0.61: R2.1 36.7,11.43 35.56,11.43 34.29,12.7 34.29,15.24 33.02,16.51 SV3.2 24.13,16.51 16.51,8.89 WEMOS1.D3
N$11  (via drill 0.38)
  other vias: 114.3,40.64
  pour Bottom: 130.81,34.29 130.81,63.18 76.2,63.18 76.2,34.29
  pour Top: 76.2,34.29 130.81,34.29 130.81,63.18 76.2,63.18
P_GND
  Bottom 0.406: DIS1.1 97.16,50.16 D2.A

### Text on the board
tNames: IN - | IN+ | OUT+